# Altium schematic sheet powersupply_grid8_1.SchDoc: powersupply_grid8.sch
size 409 x 282 mm; Date: 12/19/2018 10:57:12 PM; SheetNumber: Sheet:
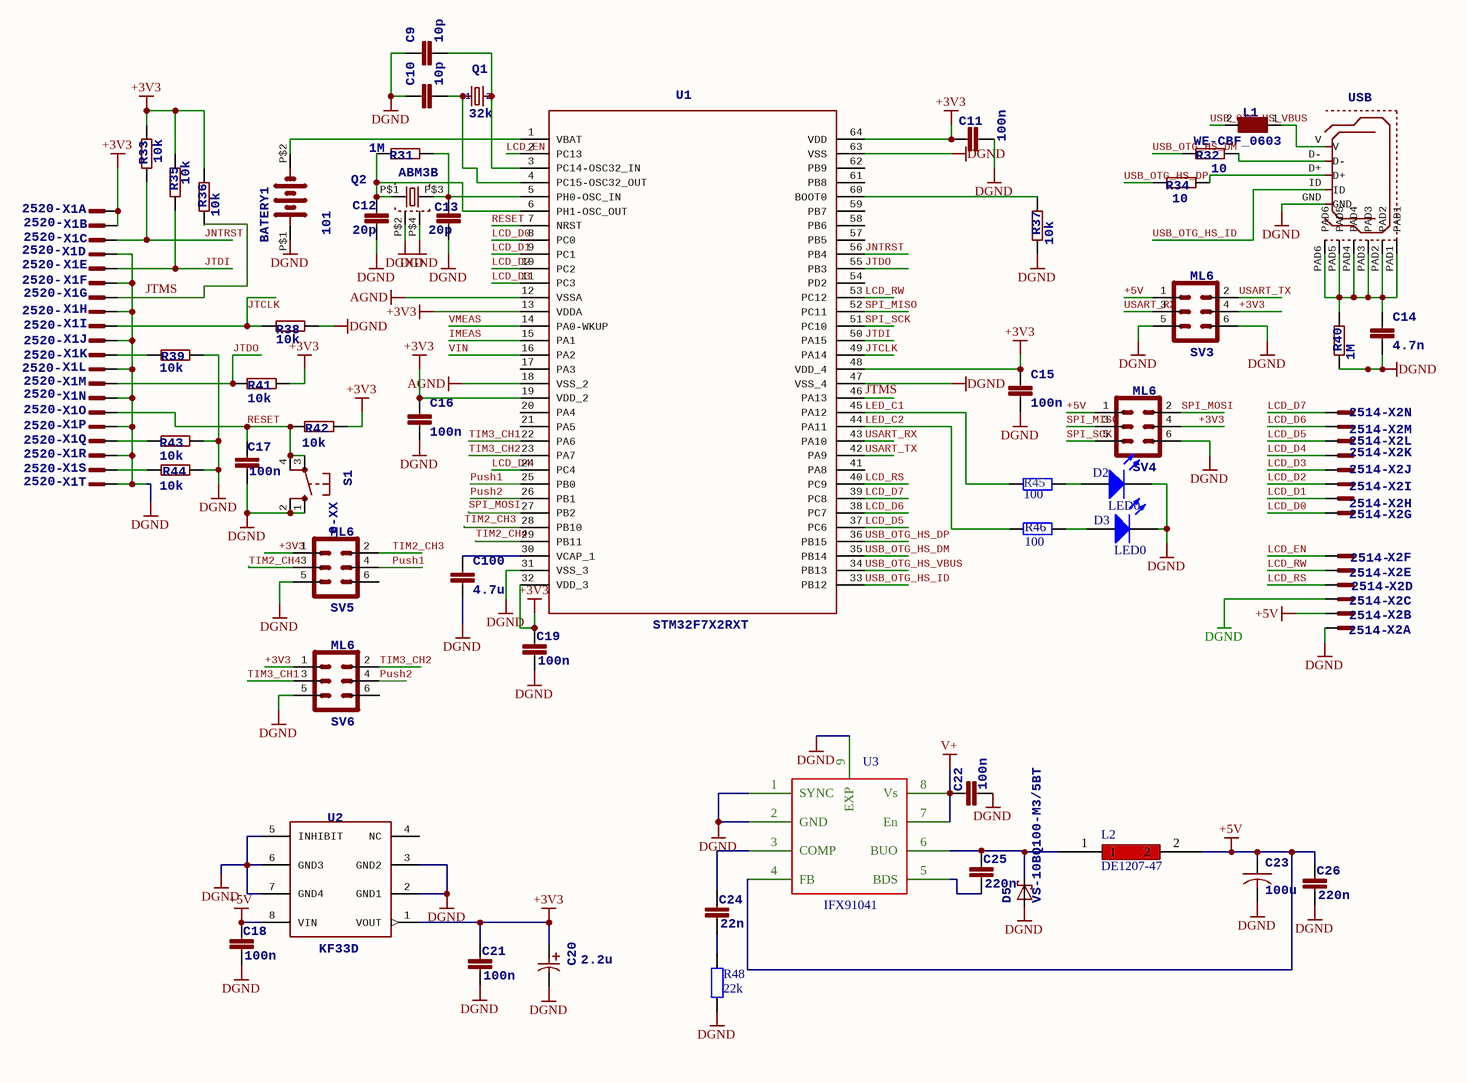
[diagram p0: powersupply_grid8_1.SchDoc]

## Parts
BATERY1  101  [KEYSTONE101]
C9  10p  [C0402]
C10  10p  [C0402]
C11  100n  [C0402]
C12  20p  [C0402]
C13  20p  [C0402]
C14  4.7n  [C0805]
C15  100n  [C0402]
C16  100n  [C0402]
C17  100n  [C0402]
C18  100n  [C0603]
C19  100n  [C0603]
C20  2.2u  [CAPAE430X610N]
C21  100n  [C0603]
C22  100n  [C0603]
C23  100u  [C2225K]
C24  22n  [C0603]
C25  220n  [C0603]
C26  220n  [C0603]
C100  4.7u  [C0805]
D2  LED0  [LED-0]
D3  LED0  [LED-0]
D5  VS-10BQ100-M3/5BT  [DO214AA]
L1  WE-CBF_0603  [0603]
L2  DE1207-47  [DE1207]
Q1  32k  [TC26V]
Q2  ABM3B  [ABM3B]
R31  1M  [R0402]
R32  10  [R0805]
R33  10k  [R0805]
R34  10  [R0805]
R35  10k  [R0805]
R36  10k  [R0805]
R37  10k  [R0805]
R38  10k  [R0805]
R39  10k  [R0805]
R40  1M  [R0805]
R41  10k  [R0805]
R42  10k  [R0805]
R43  10k  [R0805]
R44  10k  [R0805]
R45  value 100  [6-0805_L]  (hidden comment: Res2)
R46  value 100  [6-0805_L]  (hidden comment: Res2)
R48  value 22k  [6-0805_L]  (hidden comment: Res2)
S1  10-XX  [B3F-10XX]
SV3  ML6  [ML6]
SV4  ML6  [ML6]
SV5  ML6  [ML6]
SV6  ML6  [ML6]
U1  STM32F7X2RXT  [LQFP64-10X10MM]
U2  KF33D  [SO8]
U3  IFX91041  [PG-DSO-8-27]
U$4  USB_MICROB  [USB_MICROB_PACKAGE]  (value not drawn)
X1  2520-  [PAK100/2500-20]  (parts A,B,C,D,E,F,G,H,I,J,K,L,M,N,O,P,Q,R,S,T of 20)
X2  2514-  [PAK100/2500-14]  (parts A,B,C,D,E,F,G,H,I,J,K,L,M,N of 14)

## Nets
+3V3: C11.1 C15.1 C16.1 C19.1 C20.1 C21.1 R33.2 R35.2 R36.2 R41.1 R42.1 SV3.4 SV4.4 SV5.1 SV6.1 U1.13(VDDA) U1.19(VDD_2) U1.32(VDD_3) U1.48(VDD_4) U1.64(VDD) U2.1(VOUT) X1.1(KL) X1.2(KL)
+5V: C18.1 C23.1 C26.1 L2.2 SV3.1 SV4.1 U2.8(VIN) U3.4(FB) X2.2(KL)
AGND: U1.12(VSSA) U1.18(VSS_2)
DGND: BATERY1.P$1(+) C9.1 C10.1 C11.2 C12.2 C13.2 C14.2 C15.2 C16.2 C17.2 C18.2 C19.2 C20.2 C21.2 C22.2 C23.2 C26.2 C100.2 D2.2(K) D3.2(K) D5.A Q2.P$2 Q2.P$4 R37.1 R38.1 R39.1 R40.1 R43.1 R44.1 R48.1 S1.1(S) S1.2(S1) SV3.5 SV3.6 SV4.6 SV5.5 SV6.5 U1.31(VSS_3) U1.47(VSS_4) U1.63(VSS) U2.2(GND1) U2.3(GND2) U2.5(INHIBIT) U2.6(GND3) U2.7(GND4) U3.1(SYNC) U3.2(GND) U3.9(EXP) U$4.GND X1.4(KL) X1.6(KL) X1.8(KL) X1.10(KL) X1.12(KL) X1.14(KL) X1.16(KL) X1.18(KL) X1.20(KL) X2.1(KL) X2.3(KL)
V+: C22.1 U3.7(En) U3.8(Vs)
IMEAS: U1.15(PA1)
JNTRST: R33.1 U1.56(PB4) X1.3(KL)
JTCLK: R38.2 U1.49(PA14) X1.9(KL)
JTDI: R35.1 U1.50(PA15) X1.5(KL)
JTDO: R41.2 U1.55(PB3) X1.13(KL)
JTMS: R36.1 U1.46(PA13) X1.7(KL)
LCD_D0: U1.8(PC0) X2.7(KL)
LCD_D1: U1.9(PC1) X2.8(KL)
LCD_D2: U1.10(PC2) X2.9(KL)
LCD_D3: U1.11(PC3) X2.10(KL)
LCD_D4: U1.24(PC4) X2.11(KL)
LCD_D5: U1.37(PC6) X2.12(KL)
LCD_D6: U1.38(PC7) X2.13(KL)
LCD_D7: U1.39(PC8) X2.14(KL)
LCD_EN: U1.2(PC13) X2.6(KL)
LCD_RS: U1.40(PC9) X2.4(KL)
LCD_RW: U1.53(PC12) X2.5(KL)
LED_C1: R45.1 U1.45(PA12)
LED_C2: R46.1 U1.44(PA11)
Push1: SV5.4 U1.25(PB0)
Push2: SV6.4 U1.26(PB1)
RESET: C17.1 R42.2 S1.3(P) S1.4(P1) U1.7(NRST) X1.15(KL)
SPI_MISO: SV4.3 U1.52(PC11)
SPI_MOSI: SV4.2 U1.27(PB2)
SPI_SCK: SV4.5 U1.51(PC10)
TIM2_CH3: SV5.2 U1.28(PB10)
TIM2_CH4: SV5.3 U1.29(PB11)
TIM3_CH1: SV6.3 U1.22(PA6)
TIM3_CH2: SV6.2 U1.23(PA7)
USART_RX: SV3.3 U1.43(PA10)
USART_TX: SV3.2 U1.42(PA9)
USB_OTG_HS_DM: R32.2 U1.35(PB14)
USB_OTG_HS_DP: R34.2 U1.36(PB15)
USB_OTG_HS_ID: U1.33(PB12) U$4.ID
USB_OTG_HS_VBUS: L1.2 U1.34(PB13)
VIN: U1.16(PA2)
VMEAS: U1.14(PA0-WKUP)
NetBATERY1_P$2: BATERY1.P$2(-) U1.1(VBAT)
NetC9_2: C9.2 Q1.2 U1.3(PC14-OSC32_IN)
NetC10_2: C10.2 Q1.1 U1.4(PC15-OSC32_OUT)
NetC12_1: C12.1 Q2.P$1 R31.2 U1.6(PH1-OSC_OUT)
NetC13_1: C13.1 Q2.P$3 R31.1 U1.5(PH0-OSC_IN)
NetC14_1: C14.1 R40.2 U$4.PAD1 U$4.PAD2 U$4.PAD3 U$4.PAD4 U$4.PAD5 U$4.PAD6
NetC24_1: C24.1 U3.3(COMP)
NetC24_2: C24.2 R48.2
NetC25_1: C25.1 D5.C L2.1 U3.6(BUO)
NetC25_2: C25.2 U3.5(BDS)
NetC100_1: C100.1 U1.30(VCAP_1)
NetD2_1: D2.1(A) R45.2
NetD3_1: D3.1(A) R46.2
NetL1_1: L1.1 U$4.V
NetR32_1: R32.1 U$4.D-
NetR34_1: R34.1 U$4.D+
NetR37_2: R37.2 U1.60(BOOT0)
NetR39_2: R39.2 X1.11(KL)
NetR43_2: R43.2 X1.17(KL)
NetR44_2: R44.2 X1.19(KL)

Not connected (* = marked no-connect by the designer): SV5 6; SV6 6; U1 17(PA3) 20(PA4) 21(PA5) 41(PA8) 54(PD2) 57(PB5) 58(PB6) 59(PB7) 61(PB8) 62(PB9); U2 4(NC)

## Notes on the sheet
- 1
- 2
- 3
- 4
- 5
- 6
- 7
- 8
- A
- B
- C
- D
- E

## Library data of the parts
C9-C13 C15-C17 = C-EUC0402: <B>CAPACITOR</B>, European symbol; SPICEPREFIX: C
C14 = C-EUC0805: <B>CAPACITOR</B>, European symbol; SPICEPREFIX: C
C18 C19 C21 C22 C24-C26 = C-EUC0603: <B>CAPACITOR</B>, European symbol; SPICEPREFIX: C
C20 = EEE--CASE-B: MPN: EEE-FT0J101AR; MPN: EEE-FT1A680AR; MPN: EEE-FT1C470AR; MPN: EEE-FT1E220AR; MPN: EEE-FT1E330AR; MPN: EEE-FT1V220AR; MPN: EEE-FTH100UAR; MPN: EEE-HA0J220R; MPN: EEE-HA0J330WR; MPN: EEE-HA0J470WR; MPN: EEE-HA1A220WR; MPN: EEE-HA1A330WR; MPN: EEE-HA1C100R; MPN: EEE-HA1C220WR; MPN: EEE-HA1E100WR; MPN: EEE-HA1E4R7R; MPN: EEE-HA1H1R0R; MPN: EEE-HA1H2R2R; MPN: EEE-HA1H3R3R; MPN: EEE-HA1HR10R; MPN: EEE-HA1HR22R; MPN: EEE-HA1HR33R; MPN: EEE-HA1HR47R; MPN: EEE-HA1V100WR; MPN: EEE-HA1V4R7R; MPN: EEE-HB0J220R; MPN: EEE-HB1C100R; MPN: EEE-HB1E4R7R; MPN: EEE-HB1H1R0R; MPN: EEE-HB1H2R2R; MPN: EEE-HC0J220R; MPN: EEE-HC1C100R; MPN: EEE-HC1H1R0R; MPN: EEE-HC1H2R2R; MPN: EEE-HC1H3R3R; MPN: EEE-HC1HR10R; MPN: EEE-HC1HR33R; MPN: EEE-HC1HR47R; TOLERANCE: ±20 %; VOLTAGERATING: 6.3V; VOLTAGERATING: 10V; VOLTAGERATING: 16V; VOLTAGERATING: 25V; VOLTAGERATING: 35V; VOLTAGERATING: 50V; OC_FARNELL: 2065951; OC_NEWARK: 73T9146; PACKAGE: CASE-B; SUPPLIER: PANASONIC; OC_FARNELL: 2065959; OC_NEWARK: 73T9155; OC_FARNELL: 2065967; OC_NEWARK: 73T9160; OC_FARNELL: 1868402; OC_NEWARK: 31T8175; OC_FARNELL: 1868403; OC_NEWARK: 53W8320; OC_FARNELL: 1868413; OC_NEWARK: 31T8187; OC_FARNELL: 1868422; OC_NEWARK: 31T8171; OC_FARNELL: 1973274; OC_NEWARK: 58T9198; OC_FARNELL: 1973275; OC_NEWARK: 58T9199; OC_FARNELL: 1973276; OC_NEWARK: 58T9204; OC_FARNELL: 1973288; OC_NEWARK: 58T9209; OC_FARNELL: 1973291; OC_NEWARK: 58T9213; OC_FARNELL: 1973301; OC_NEWARK: 58T9217; OC_FARNELL: 1973302; OC_NEWARK: 58T9220; OC_FARNELL: 1973318; OC_NEWARK: 58T9233; OC_FARNELL: 1973317; OC_NEWARK: 58T9245; OC_FARNELL: 1973358; OC_NEWARK: 58T9253; OC_FARNELL: 1973359; OC_NEWARK: 58T9257; OC_FARNELL: 1973360; OC_NEWARK: 58T9260; OC_FARNELL: 1973353; OC_NEWARK: 58T9249; OC_FARNELL: 1973354; OC_NEWARK: 58T9250; OC_FARNELL: 1973355; OC_NEWARK: 58T9251; OC_FARNELL: 1973357; OC_NEWARK: unknown; OC_FARNELL: 1973338; OC_NEWARK: 58T9275; OC_FARNELL: 1973337; OC_NEWARK: 58T9286; OC_FARNELL: 9696750; OC_NEWARK: 96K9411; OC_FARNELL: 9696792; OC_NEWARK: 96K9414; OC_FARNELL: 9696822; OC_NEWARK: 96K9418; OC_FARNELL: 9696857; OC_NEWARK: 96K9419; OC_FARNELL: 9696865; OC_NEWARK: 96K9421; OC_FARNELL: 1714683; OC_NEWARK: 15R0902; OC_FARNELL: 1714692; OC_NEWARK: 15R0908; OC_FARNELL: 1714712; OC_NEWARK: 15R0921; OC_FARNELL: 1714713; OC_NEWARK: 15R0924; OC_FARNELL: 1714714; OC_NEWARK: 15R0926; OC_FARNELL: 1714708; OC_NEWARK: 15R0917; OC_FARNELL: 1714710; OC_NEWARK: 15R0919; OC_FARNELL: 1714711; OC_NEWARK: 15R0920
C23 = C-USC2225K: SPICEPREFIX: C
C100 = C-EUC0805: SPICEPREFIX: C
D2 D3 = LED0: Typical INFRARED GaAs LED; Published: 8-Jun-2000; LatestRevisionDate: 08-Jul-2005; LatestRevisionNote: Mech Layer 1 removed.; PackageReference: LED-0; Publisher: Altium Limited; PackageDescription: LED; 2 Leads
D5 = SCHOTTKY-DIODEAG
L1 = WE-CBF_0603: <b> SMD EMI Suppression Ferrite Beads WE-CBF</b> <p> / - Excellent anti-EMI properties <br> / - Low DC-restistance <br> / - Impedances till 3000 ohms <br> / - Rated current up to 6 A<p> / -- Reliable Ni-Sn electrodes<br> / -- Perfect as data lined filter and for uncoupling of distribution voltage<br>; MPN: 742792695; OC_FARNELL: 1635699; OC_NEWARK: 08P2449; PACKAGE: IND-0603; SUPPLIER: Wuerth Elektronik
L2 = DE 1207
Q1 = CRYSTALTC26V: <b>CRYSTAL</b>; OC_FARNELL: unknown; OC_NEWARK: unknown; 1: 1; 2: 2
R31 = R-EU_R0402: <B>RESISTOR</B>, European symbol
R32-R44 = R-EU_R0805: <B>RESISTOR</B>, European symbol
R45 R46 R48 = Res2: Resistor; Published: 8-Jun-2000; LatestRevisionDate: 17-Jul-2002; LatestRevisionNote: Re-released for DXP Platform.; PackageReference: AXIAL-0.4; Publisher: Altium Limited; PackageDescription: Axial Device, Thru-Hole; 2 Leads; 0.4 in Pin Spacing
S1 = 10-XX: <b>OMRON SWITCH</b>; MPN: B3F-1000; OC_FARNELL: 176432; OC_NEWARK: 36M3542
SV3-SV6 = ML6: <b>HARTING</b>; OC_FARNELL: unknown; OC_NEWARK: unknown
U1 = STM32F7X2RXT: VENDOR: STMicroelectronics; MANUFACTURER_PART_NUMBER: stm32f7x2rxt
U3 = IFX91041: 1.8A DC/DC Step-Down Voltage Regulator
U$4 = USB_MICROB: This is the hirose ZX62-B-5PA(11) MICRO-USB B Type female connection.; USB: USB
X1 = 2520-: <b>3M (TM) Pak 100 4-Wall Header</b><p> / Source: 3M; OC_FARNELL: unknown; OC_NEWARK: unknown
X2 = 2514-: <b>3M (TM) Pak 100 4-Wall Header</b><p> / Source: 3M; OC_FARNELL: unknown; OC_NEWARK: unknown